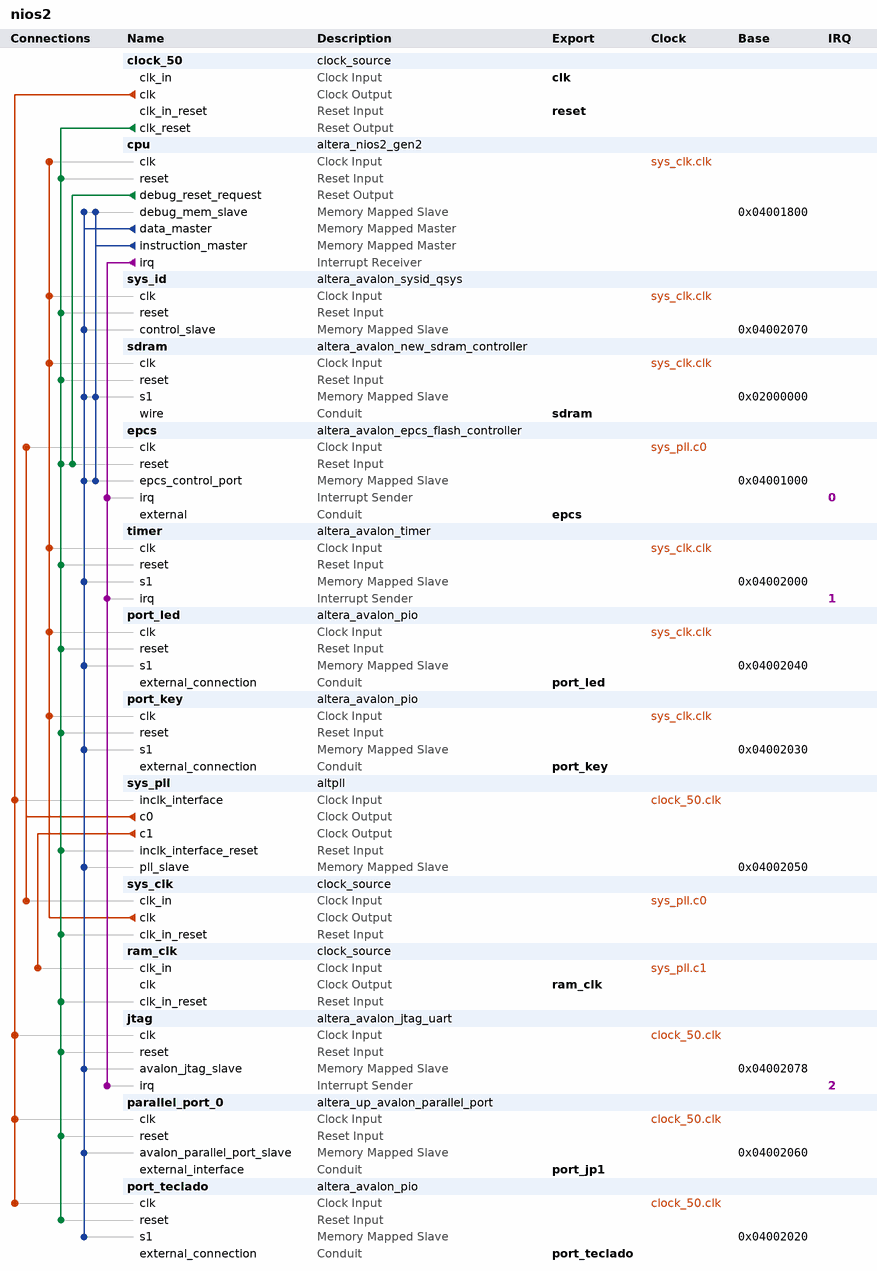
[diagram p0: system contents]
# Platform Designer (Qsys) system nios2, Cyclone IV E EP4CE22F17C6
# Parameters at their usual value, and those the tool derives, are not listed.
package require -exact qsys 15.1
create_system nios2
set_project_property DEVICE_FAMILY {Cyclone IV E}
set_project_property DEVICE EP4CE22F17C6

add_instance clock_50 clock_source 15.1
set_instance_parameter_value clock_50 clockFrequency 50000000

add_instance cpu altera_nios2_gen2 15.1
set_instance_parameter_value cpu dcache_size 2048
set_instance_parameter_value cpu exceptionSlave sdram.s1
set_instance_parameter_value cpu icache_size 4096
set_instance_parameter_value cpu impl Tiny
set_instance_parameter_value cpu resetSlave epcs.epcs_control_port

add_instance sys_id altera_avalon_sysid_qsys 15.1
set_instance_parameter_value sys_id id 0

add_instance sdram altera_avalon_new_sdram_controller 15.1
set_instance_parameter_value sdram TAC 5.5
set_instance_parameter_value sdram TRCD 20.0
set_instance_parameter_value sdram TRP 20.0
set_instance_parameter_value sdram casLatency 3
set_instance_parameter_value sdram columnWidth 9
set_instance_parameter_value sdram dataWidth 16
set_instance_parameter_value sdram generateSimulationModel false
set_instance_parameter_value sdram model custom
set_instance_parameter_value sdram numberOfBanks 4
set_instance_parameter_value sdram numberOfChipSelects 1
set_instance_parameter_value sdram powerUpDelay 100.0
set_instance_parameter_value sdram refreshPeriod 15.625
set_instance_parameter_value sdram rowWidth 13

add_instance epcs altera_avalon_epcs_flash_controller 15.1
set_instance_parameter_value epcs resetrequest_enabled true

add_instance timer altera_avalon_timer 15.1
set_instance_parameter_value timer period 1
set_instance_parameter_value timer periodUnits MSEC

add_instance port_led altera_avalon_pio 15.1
set_instance_parameter_value port_led direction Output
set_instance_parameter_value port_led width 8

add_instance port_key altera_avalon_pio 15.1
set_instance_parameter_value port_key direction Input
set_instance_parameter_value port_key width 4

add_instance sys_pll altpll 15.1
set_instance_parameter_value sys_pll CLK0_DIVIDE_BY 1
set_instance_parameter_value sys_pll CLK0_MULTIPLY_BY 2
set_instance_parameter_value sys_pll CLK1_DIVIDE_BY 1
set_instance_parameter_value sys_pll CLK1_DUTY_CYCLE 50
set_instance_parameter_value sys_pll CLK1_MULTIPLY_BY 2
set_instance_parameter_value sys_pll CLK1_PHASE_SHIFT -1667
set_instance_parameter_value sys_pll INCLK0_INPUT_FREQUENCY 20000
set_instance_parameter_value sys_pll PORT_ARESET PORT_USED
set_instance_parameter_value sys_pll PORT_LOCKED PORT_USED
set_instance_parameter_value sys_pll PORT_clk1 PORT_USED
set_instance_parameter_value sys_pll PORT_clk2 PORT_UNUSED
set_instance_parameter_value sys_pll PORT_clk3 PORT_UNUSED

add_instance sys_clk clock_source 15.1
set_instance_parameter_value sys_clk clockFrequency 100000000

add_instance ram_clk clock_source 15.1
set_instance_parameter_value ram_clk clockFrequency 100000000

add_instance jtag altera_avalon_jtag_uart 15.1
set_instance_parameter_value jtag simInteractiveOptions INTERACTIVE_ASCII_OUTPUT

add_instance parallel_port_0 altera_up_avalon_parallel_port 15.1
set_instance_parameter_value parallel_port_0 board DE0-Nano
set_instance_parameter_value parallel_port_0 capture false
set_instance_parameter_value parallel_port_0 edge Rising
set_instance_parameter_value parallel_port_0 gpio {GPIO 1 (JP2)}
set_instance_parameter_value parallel_port_0 irq false
set_instance_parameter_value parallel_port_0 preset {Expansion Header}

add_instance port_teclado altera_avalon_pio 15.1
set_instance_parameter_value port_teclado direction Input
set_instance_parameter_value port_teclado width 4

# connections
add_connection clock_50.clk jtag.clk clock
add_connection clock_50.clk parallel_port_0.clk clock
add_connection clock_50.clk port_teclado.clk clock
add_connection clock_50.clk sys_pll.inclk_interface clock
add_connection sys_clk.clk cpu.clk clock
add_connection sys_clk.clk port_key.clk clock
add_connection sys_clk.clk port_led.clk clock
add_connection sys_clk.clk sdram.clk clock
add_connection sys_clk.clk sys_id.clk clock
add_connection sys_clk.clk timer.clk clock
add_connection sys_pll.c0 epcs.clk clock
add_connection sys_pll.c0 sys_clk.clk_in clock
add_connection sys_pll.c1 ram_clk.clk_in clock
add_connection clock_50.clk_reset cpu.reset reset
add_connection clock_50.clk_reset epcs.reset reset
add_connection clock_50.clk_reset jtag.reset reset
add_connection clock_50.clk_reset parallel_port_0.reset reset
add_connection clock_50.clk_reset port_key.reset reset
add_connection clock_50.clk_reset port_led.reset reset
add_connection clock_50.clk_reset port_teclado.reset reset
add_connection clock_50.clk_reset ram_clk.clk_in_reset reset
add_connection clock_50.clk_reset sdram.reset reset
add_connection clock_50.clk_reset sys_clk.clk_in_reset reset
add_connection clock_50.clk_reset sys_id.reset reset
add_connection clock_50.clk_reset sys_pll.inclk_interface_reset reset
add_connection clock_50.clk_reset timer.reset reset
add_connection cpu.debug_reset_request epcs.reset reset
add_connection cpu.data_master cpu.debug_mem_slave avalon
set_connection_parameter_value cpu.data_master/cpu.debug_mem_slave baseAddress 0x04001800
add_connection cpu.data_master epcs.epcs_control_port avalon
set_connection_parameter_value cpu.data_master/epcs.epcs_control_port baseAddress 0x04001000
add_connection cpu.data_master jtag.avalon_jtag_slave avalon
set_connection_parameter_value cpu.data_master/jtag.avalon_jtag_slave baseAddress 0x04002078
add_connection cpu.data_master parallel_port_0.avalon_parallel_port_slave avalon
set_connection_parameter_value cpu.data_master/parallel_port_0.avalon_parallel_port_slave baseAddress 0x04002060
add_connection cpu.data_master port_key.s1 avalon
set_connection_parameter_value cpu.data_master/port_key.s1 baseAddress 0x04002030
add_connection cpu.data_master port_led.s1 avalon
set_connection_parameter_value cpu.data_master/port_led.s1 baseAddress 0x04002040
add_connection cpu.data_master port_teclado.s1 avalon
set_connection_parameter_value cpu.data_master/port_teclado.s1 baseAddress 0x04002020
add_connection cpu.data_master sdram.s1 avalon
set_connection_parameter_value cpu.data_master/sdram.s1 baseAddress 0x02000000
add_connection cpu.data_master sys_id.control_slave avalon
set_connection_parameter_value cpu.data_master/sys_id.control_slave baseAddress 0x04002070
add_connection cpu.data_master sys_pll.pll_slave avalon
set_connection_parameter_value cpu.data_master/sys_pll.pll_slave baseAddress 0x04002050
add_connection cpu.data_master timer.s1 avalon
set_connection_parameter_value cpu.data_master/timer.s1 baseAddress 0x04002000
add_connection cpu.instruction_master cpu.debug_mem_slave avalon
set_connection_parameter_value cpu.instruction_master/cpu.debug_mem_slave baseAddress 0x04001800
add_connection cpu.instruction_master epcs.epcs_control_port avalon
set_connection_parameter_value cpu.instruction_master/epcs.epcs_control_port baseAddress 0x04001000
add_connection cpu.instruction_master sdram.s1 avalon
set_connection_parameter_value cpu.instruction_master/sdram.s1 baseAddress 0x02000000
add_connection cpu.irq epcs.irq interrupt
set_connection_parameter_value cpu.irq/epcs.irq irqNumber 0
add_connection cpu.irq jtag.irq interrupt
set_connection_parameter_value cpu.irq/jtag.irq irqNumber 2
add_connection cpu.irq timer.irq interrupt
set_connection_parameter_value cpu.irq/timer.irq irqNumber 1

# exported interfaces
add_interface clk clock sink
set_interface_property clk EXPORT_OF clock_50.clk_in
add_interface epcs conduit end
set_interface_property epcs EXPORT_OF epcs.external
add_interface port_jp1 conduit end
set_interface_property port_jp1 EXPORT_OF parallel_port_0.external_interface
add_interface port_key conduit end
set_interface_property port_key EXPORT_OF port_key.external_connection
add_interface port_led conduit end
set_interface_property port_led EXPORT_OF port_led.external_connection
add_interface port_teclado conduit end
set_interface_property port_teclado EXPORT_OF port_teclado.external_connection
add_interface ram_clk clock source
set_interface_property ram_clk EXPORT_OF ram_clk.clk
add_interface reset reset sink
set_interface_property reset EXPORT_OF clock_50.clk_in_reset
add_interface sdram conduit end
set_interface_property sdram EXPORT_OF sdram.wire

set_interconnect_requirement {$system} qsys_mm.clockCrossingAdapter HANDSHAKE
set_interconnect_requirement {$system} qsys_mm.maxAdditionalLatency 1

save_system nios2.qsys
